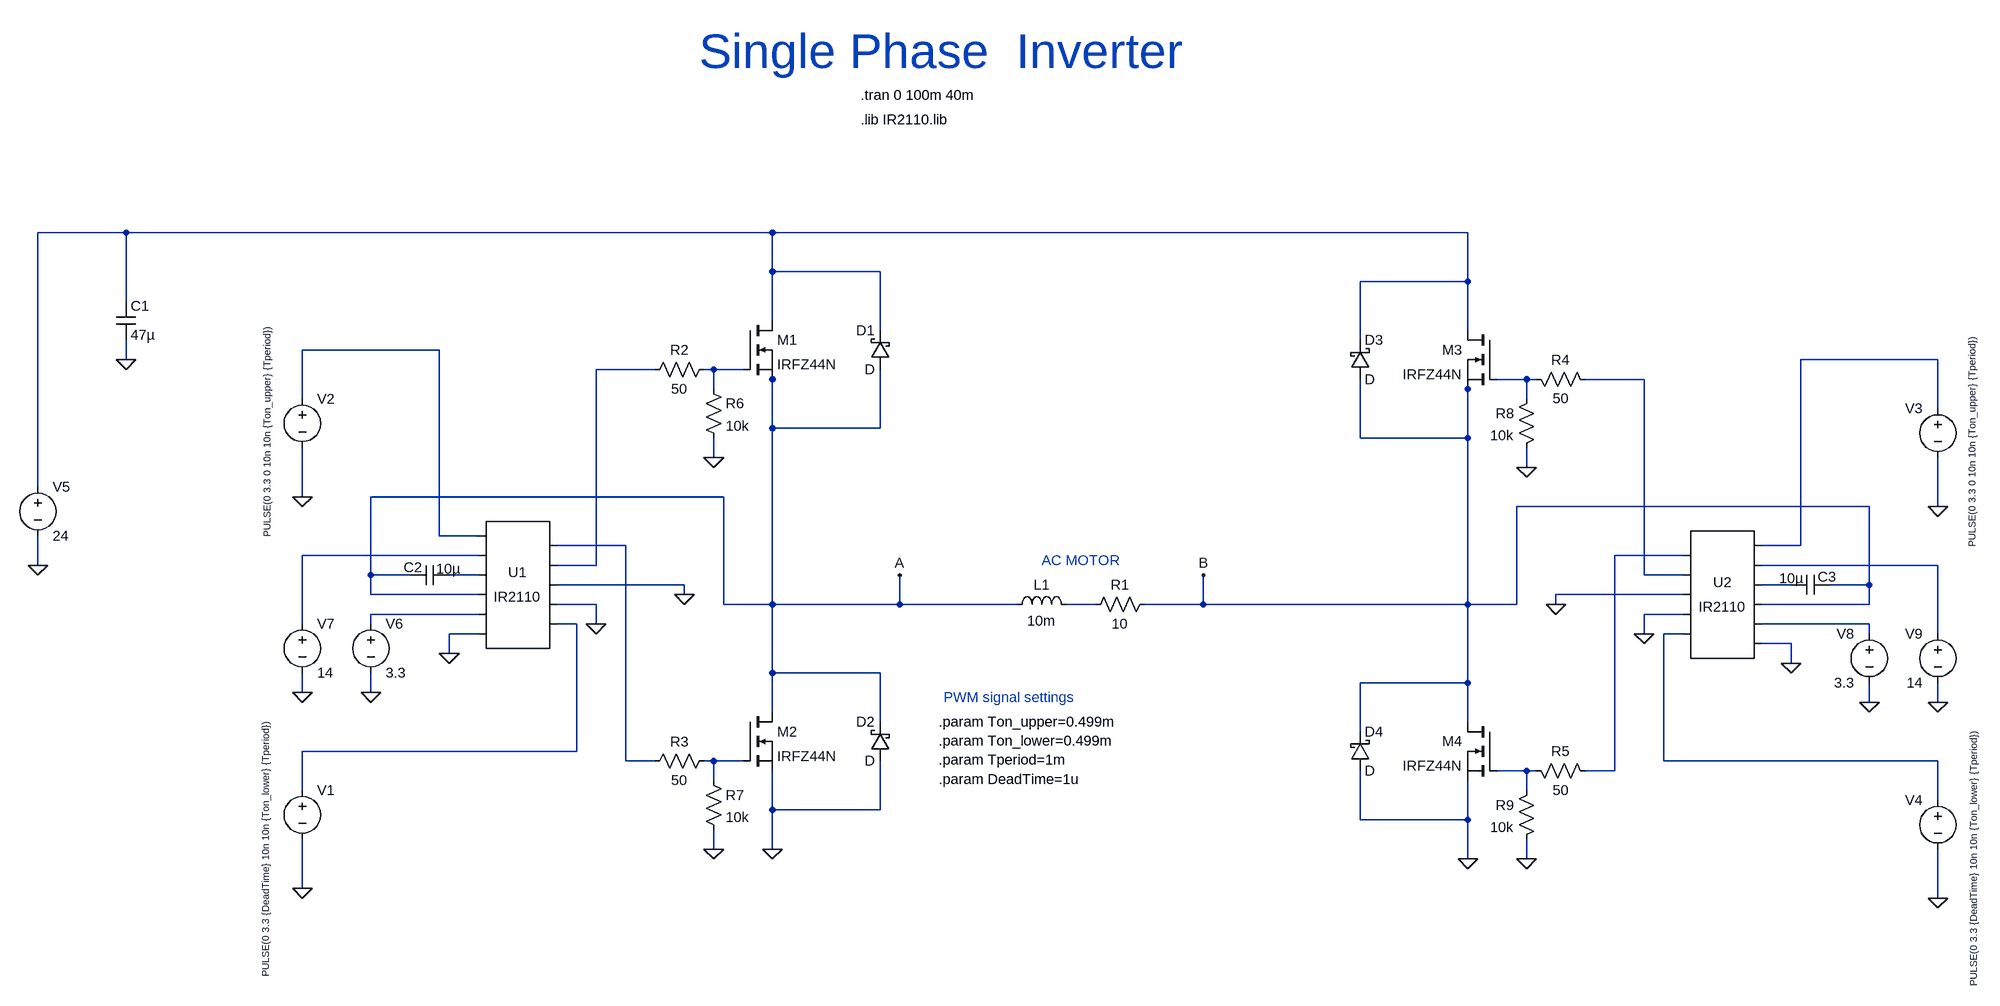
[diagram p0: schematic schematic inverter SP.asc]
schematic inverter SP.asc, the LTspice schematic file:
Version 4
SHEET 1 2400 1076
WIRE -688 -192 -832 -192
WIRE 368 -192 -688 -192
WIRE 1504 -192 368 -192
WIRE 368 -128 368 -192
WIRE 544 -128 368 -128
WIRE 1504 -112 1504 -192
WIRE 1504 -112 1328 -112
WIRE -688 -80 -688 -192
WIRE 368 -48 368 -128
WIRE 544 -32 544 -128
WIRE 1504 -32 1504 -112
WIRE 1328 -16 1328 -112
WIRE -176 0 -400 0
WIRE -688 16 -688 -16
WIRE 2272 16 2048 16
WIRE 176 32 80 32
WIRE 272 32 256 32
WIRE 320 32 272 32
WIRE 368 48 368 32
WIRE 1600 48 1552 48
WIRE 1616 48 1600 48
WIRE 1792 48 1696 48
WIRE 272 64 272 32
WIRE 1504 64 1504 48
WIRE -400 80 -400 0
WIRE 1600 80 1600 48
WIRE 2272 96 2272 16
WIRE 368 128 368 48
WIRE 544 128 544 32
WIRE 544 128 368 128
WIRE 1328 144 1328 48
WIRE 1504 144 1504 64
WIRE 1504 144 1328 144
WIRE 272 176 272 144
WIRE 1600 192 1600 160
WIRE -832 224 -832 -192
WIRE -400 240 -400 160
WIRE 288 240 -288 240
WIRE 2160 256 1584 256
WIRE 2272 256 2272 176
WIRE -176 304 -176 0
WIRE -112 304 -176 304
WIRE 128 320 16 320
WIRE 2048 320 2048 16
WIRE 2048 320 1984 320
WIRE -112 336 -400 336
WIRE 1856 336 1744 336
WIRE -832 352 -832 304
WIRE 80 352 80 32
WIRE 80 352 16 352
WIRE 2272 352 1984 352
WIRE -288 368 -288 240
WIRE -224 368 -288 368
WIRE -112 368 -160 368
WIRE 1792 368 1792 48
WIRE 1856 368 1792 368
WIRE 224 384 16 384
WIRE 2032 384 1984 384
WIRE 2160 384 2160 256
WIRE 2160 384 2096 384
WIRE -288 400 -288 368
WIRE -112 400 -288 400
WIRE 224 400 224 384
WIRE 1856 400 1648 400
WIRE 80 416 16 416
WIRE 288 416 288 240
WIRE 368 416 368 128
WIRE 368 416 288 416
WIRE 576 416 576 368
WIRE 576 416 368 416
WIRE 768 416 576 416
WIRE 896 416 848 416
WIRE 1072 416 1072 368
WIRE 1072 416 976 416
WIRE 1504 416 1504 144
WIRE 1504 416 1072 416
WIRE 1584 416 1584 256
WIRE 1584 416 1504 416
WIRE 1648 416 1648 400
WIRE 2160 416 2160 384
WIRE 2160 416 1984 416
WIRE -112 432 -288 432
WIRE 1856 432 1792 432
WIRE -400 448 -400 336
WIRE -288 448 -288 432
WIRE 48 448 16 448
WIRE 80 448 80 416
WIRE 2160 448 1984 448
WIRE -112 464 -160 464
WIRE 1792 464 1792 432
WIRE 1856 464 1824 464
WIRE 2160 464 2160 448
WIRE 2272 464 2272 352
WIRE 2032 480 1984 480
WIRE -160 496 -160 464
WIRE 2032 512 2032 480
WIRE 368 528 368 416
WIRE 544 528 368 528
WIRE 1504 544 1504 416
WIRE 1504 544 1328 544
WIRE -400 560 -400 528
WIRE -288 560 -288 528
WIRE 2160 576 2160 544
WIRE 2272 576 2272 544
WIRE 368 592 368 528
WIRE 544 608 544 528
WIRE 1504 608 1504 544
WIRE 1328 624 1328 544
WIRE 48 656 48 448
WIRE 48 656 -400 656
WIRE 128 672 128 320
WIRE 176 672 128 672
WIRE 272 672 256 672
WIRE 320 672 272 672
WIRE 1824 672 1824 464
WIRE 2272 672 1824 672
WIRE 1600 688 1552 688
WIRE 1616 688 1600 688
WIRE 1744 688 1744 336
WIRE 1744 688 1696 688
WIRE 272 704 272 672
WIRE -400 720 -400 656
WIRE 1600 720 1600 688
WIRE 2272 736 2272 672
WIRE 368 752 368 688
WIRE 544 752 544 672
WIRE 544 752 368 752
WIRE 1328 768 1328 688
WIRE 1504 768 1504 704
WIRE 1504 768 1328 768
WIRE 272 816 272 784
WIRE 368 816 368 752
WIRE 1504 832 1504 768
WIRE 1600 832 1600 800
WIRE -400 880 -400 800
WIRE 2272 896 2272 816
FLAG -400 240 0
FLAG -400 880 0
FLAG 368 816 0
FLAG -832 352 0
FLAG -688 16 0
FLAG 576 368 A
FLAG 272 816 0
FLAG 272 176 0
FLAG 224 400 0
FLAG -160 496 0
FLAG 80 448 0
FLAG -288 560 0
FLAG -400 560 0
FLAG 2272 256 0
FLAG 2272 896 0
FLAG 1504 832 0
FLAG 1600 832 0
FLAG 1600 192 0
FLAG 1648 416 0
FLAG 2032 512 0
FLAG 1792 464 0
FLAG 2160 576 0
FLAG 2272 576 0
FLAG 1072 368 B
SYMBOL voltage -832 208 R0
WINDOW 123 0 0 Left 0
WINDOW 39 0 0 Left 0
SYMATTR InstName V5
SYMATTR Value 24
SYMBOL cap -704 -80 R0
SYMATTR InstName C1
SYMATTR Value 47µ
SYMBOL ind 752 432 R270
WINDOW 0 32 56 VTop 2
WINDOW 3 5 56 VBottom 2
SYMATTR InstName L1
SYMATTR Value 10m
SYMBOL res 992 400 R90
WINDOW 0 0 56 VBottom 2
WINDOW 3 32 56 VTop 2
SYMATTR InstName R1
SYMATTR Value 10
SYMBOL nmos 320 -48 R0
SYMATTR InstName M1
SYMATTR Value IRFZ44N
SYMBOL nmos 320 592 R0
SYMATTR InstName M2
SYMATTR Value IRFZ44N
SYMBOL res 272 16 R90
WINDOW 0 0 56 VBottom 2
WINDOW 3 32 56 VTop 2
SYMATTR InstName R2
SYMATTR Value 50
SYMBOL res 272 656 R90
WINDOW 0 0 56 VBottom 2
WINDOW 3 32 56 VTop 2
SYMATTR InstName R3
SYMATTR Value 50
SYMBOL schottky 560 32 R180
WINDOW 0 24 64 Left 2
WINDOW 3 24 0 Left 2
SYMATTR InstName D1
SYMBOL schottky 560 672 R180
WINDOW 0 24 64 Left 2
WINDOW 3 24 0 Left 2
SYMATTR InstName D2
SYMBOL voltage -400 64 R0
WINDOW 123 0 0 Left 0
WINDOW 39 0 0 Left 0
WINDOW 3 -57 -98 VRight 1
SYMATTR Value PULSE(0 3.3 0 10n 10n {Ton_upper} {Tperiod})
SYMATTR InstName V2
SYMBOL voltage -400 704 R0
WINDOW 123 0 0 Left 0
WINDOW 39 0 0 Left 0
WINDOW 3 -59 -93 VRight 1
SYMATTR Value PULSE(0 3.3 {DeadTime} 10n 10n {Ton_lower} {Tperiod})
SYMATTR InstName V1
SYMBOL res 256 48 R0
SYMATTR InstName R6
SYMATTR Value 10k
SYMBOL res 256 688 R0
SYMATTR InstName R7
SYMATTR Value 10k
SYMBOL AutoGenerated\\IR2110 -48 384 M0
SYMATTR InstName U1
SYMBOL voltage -288 432 R0
WINDOW 123 0 0 Left 0
WINDOW 39 0 0 Left 0
SYMATTR InstName V6
SYMATTR Value 3.3
SYMBOL voltage -400 432 R0
WINDOW 123 0 0 Left 0
WINDOW 39 0 0 Left 0
SYMATTR InstName V7
SYMATTR Value 14
SYMBOL cap -160 352 R90
WINDOW 0 19 59 VBottom 2
WINDOW 3 -10 1 VTop 2
SYMATTR InstName C2
SYMATTR Value 10µ
SYMBOL nmos 1552 -32 M0
SYMATTR InstName M3
SYMATTR Value IRFZ44N
SYMBOL nmos 1552 608 M0
SYMATTR InstName M4
SYMATTR Value IRFZ44N
SYMBOL res 1600 32 M90
WINDOW 0 0 56 VBottom 2
WINDOW 3 32 56 VTop 2
SYMATTR InstName R4
SYMATTR Value 50
SYMBOL res 1600 672 M90
WINDOW 0 0 56 VBottom 2
WINDOW 3 32 56 VTop 2
SYMATTR InstName R5
SYMATTR Value 50
SYMBOL schottky 1312 48 M180
WINDOW 0 24 64 Left 2
WINDOW 3 24 0 Left 2
SYMATTR InstName D3
SYMBOL schottky 1312 688 M180
WINDOW 0 24 64 Left 2
WINDOW 3 24 0 Left 2
SYMATTR InstName D4
SYMBOL voltage 2272 80 M0
WINDOW 123 0 0 Left 0
WINDOW 39 0 0 Left 0
WINDOW 3 -57 -98 VRight 1
SYMATTR Value PULSE(0 3.3 0 10n 10n {Ton_upper} {Tperiod})
SYMATTR InstName V3
SYMBOL voltage 2272 720 M0
WINDOW 123 0 0 Left 0
WINDOW 39 0 0 Left 0
WINDOW 3 -59 -93 VRight 1
SYMATTR Value PULSE(0 3.3 {DeadTime} 10n 10n {Ton_lower} {Tperiod})
SYMATTR InstName V4
SYMBOL res 1616 64 M0
SYMATTR InstName R8
SYMATTR Value 10k
SYMBOL res 1616 704 M0
SYMATTR InstName R9
SYMATTR Value 10k
SYMBOL AutoGenerated\\IR2110 1920 400 R0
SYMATTR InstName U2
SYMBOL voltage 2160 448 M0
WINDOW 123 0 0 Left 0
WINDOW 39 0 0 Left 0
SYMATTR InstName V8
SYMATTR Value 3.3
SYMBOL voltage 2272 448 M0
WINDOW 123 0 0 Left 0
WINDOW 39 0 0 Left 0
SYMATTR InstName V9
SYMATTR Value 14
SYMBOL cap 2032 368 M90
WINDOW 0 19 59 VBottom 2
WINDOW 3 -10 1 VTop 2
SYMATTR InstName C3
SYMATTR Value 10µ
TEXT 248 -488 Left 6 ;Single Phase  Inverter
TEXT 512 -416 Left 2 !.tran 0 100m 40m
TEXT 808 344 Left 2 ;AC MOTOR
TEXT 640 608 Left 2 !.param Ton_upper=0.499m\n.param Ton_lower=0.499m\n.param Tperiod=1m\n.param DeadTime=1u
TEXT 648 568 Left 2 ;PWM signal settings
TEXT 512 -376 Left 2 !.lib IR2110.lib

The netlist it stands for:
* schematic inverter SP.asc
V5 N001 0 24
C1 N001 0 47µ
L1 A N014 10m
R1 B N014 10
M1 N001 N005 A A IRFZ44N
M2 A N019 0 0 IRFZ44N
R2 N005 N004 50
R3 N019 N008 50
D1 A N001 D
D2 0 A D
V2 N002 0 PULSE(0 3.3 0 10n 10n {Ton_upper} {Tperiod})
V1 N016 0 PULSE(0 3.3 {DeadTime} 10n 10n {Ton_lower} {Tperiod})
R6 N005 0 10k
R7 N019 0 10k
* U1: IR2110 (symbol AutoGenerated\IR2110 not available, pins judged from their places): pin1=N008 pin2=N004 pin3=0 pin4=0 pin5=N016 pin6=N002 pin7=N009 pin8=N012 pin9=A pin10=N015 pin11=0
V6 N015 0 3.3
V7 N009 0 14
C2 N012 A 10µ
M3 N001 N006 B B IRFZ44N
M4 B N020 0 0 IRFZ44N
R4 N006 N007 50
R5 N020 N010 50
D3 B N001 D
D4 0 B D
V3 N003 0 PULSE(0 3.3 0 10n 10n {Ton_upper} {Tperiod})
V4 N018 0 PULSE(0 3.3 {DeadTime} 10n 10n {Ton_lower} {Tperiod})
R8 N006 0 10k
R9 N020 0 10k
* U2: IR2110 (symbol AutoGenerated\IR2110 not available, pins judged from their places): pin1=N010 pin2=N007 pin3=0 pin4=0 pin5=N018 pin6=N003 pin7=N011 pin8=N013 pin9=B pin10=N017 pin11=0
V8 N017 0 3.3
V9 N011 0 14
C3 N013 B 10µ
.model D D
.lib standard.dio
.model NMOS NMOS
.model PMOS PMOS
.lib standard.mos
* Single Phase  Inverter
.tran 0 100m 40m
* AC MOTOR
.param Ton_upper=0.499m
.param Ton_lower=0.499m
.param Tperiod=1m
.param DeadTime=1u
* PWM signal settings
.lib IR2110.lib
.backanno
.end